# EAGLE design fanos (EAGLE 8.4.1)
CNAME: Fanos 9W LED Bulb Controller; CREVISION: 0.1; DESIGNER: R.E by drubicza/WTHLab
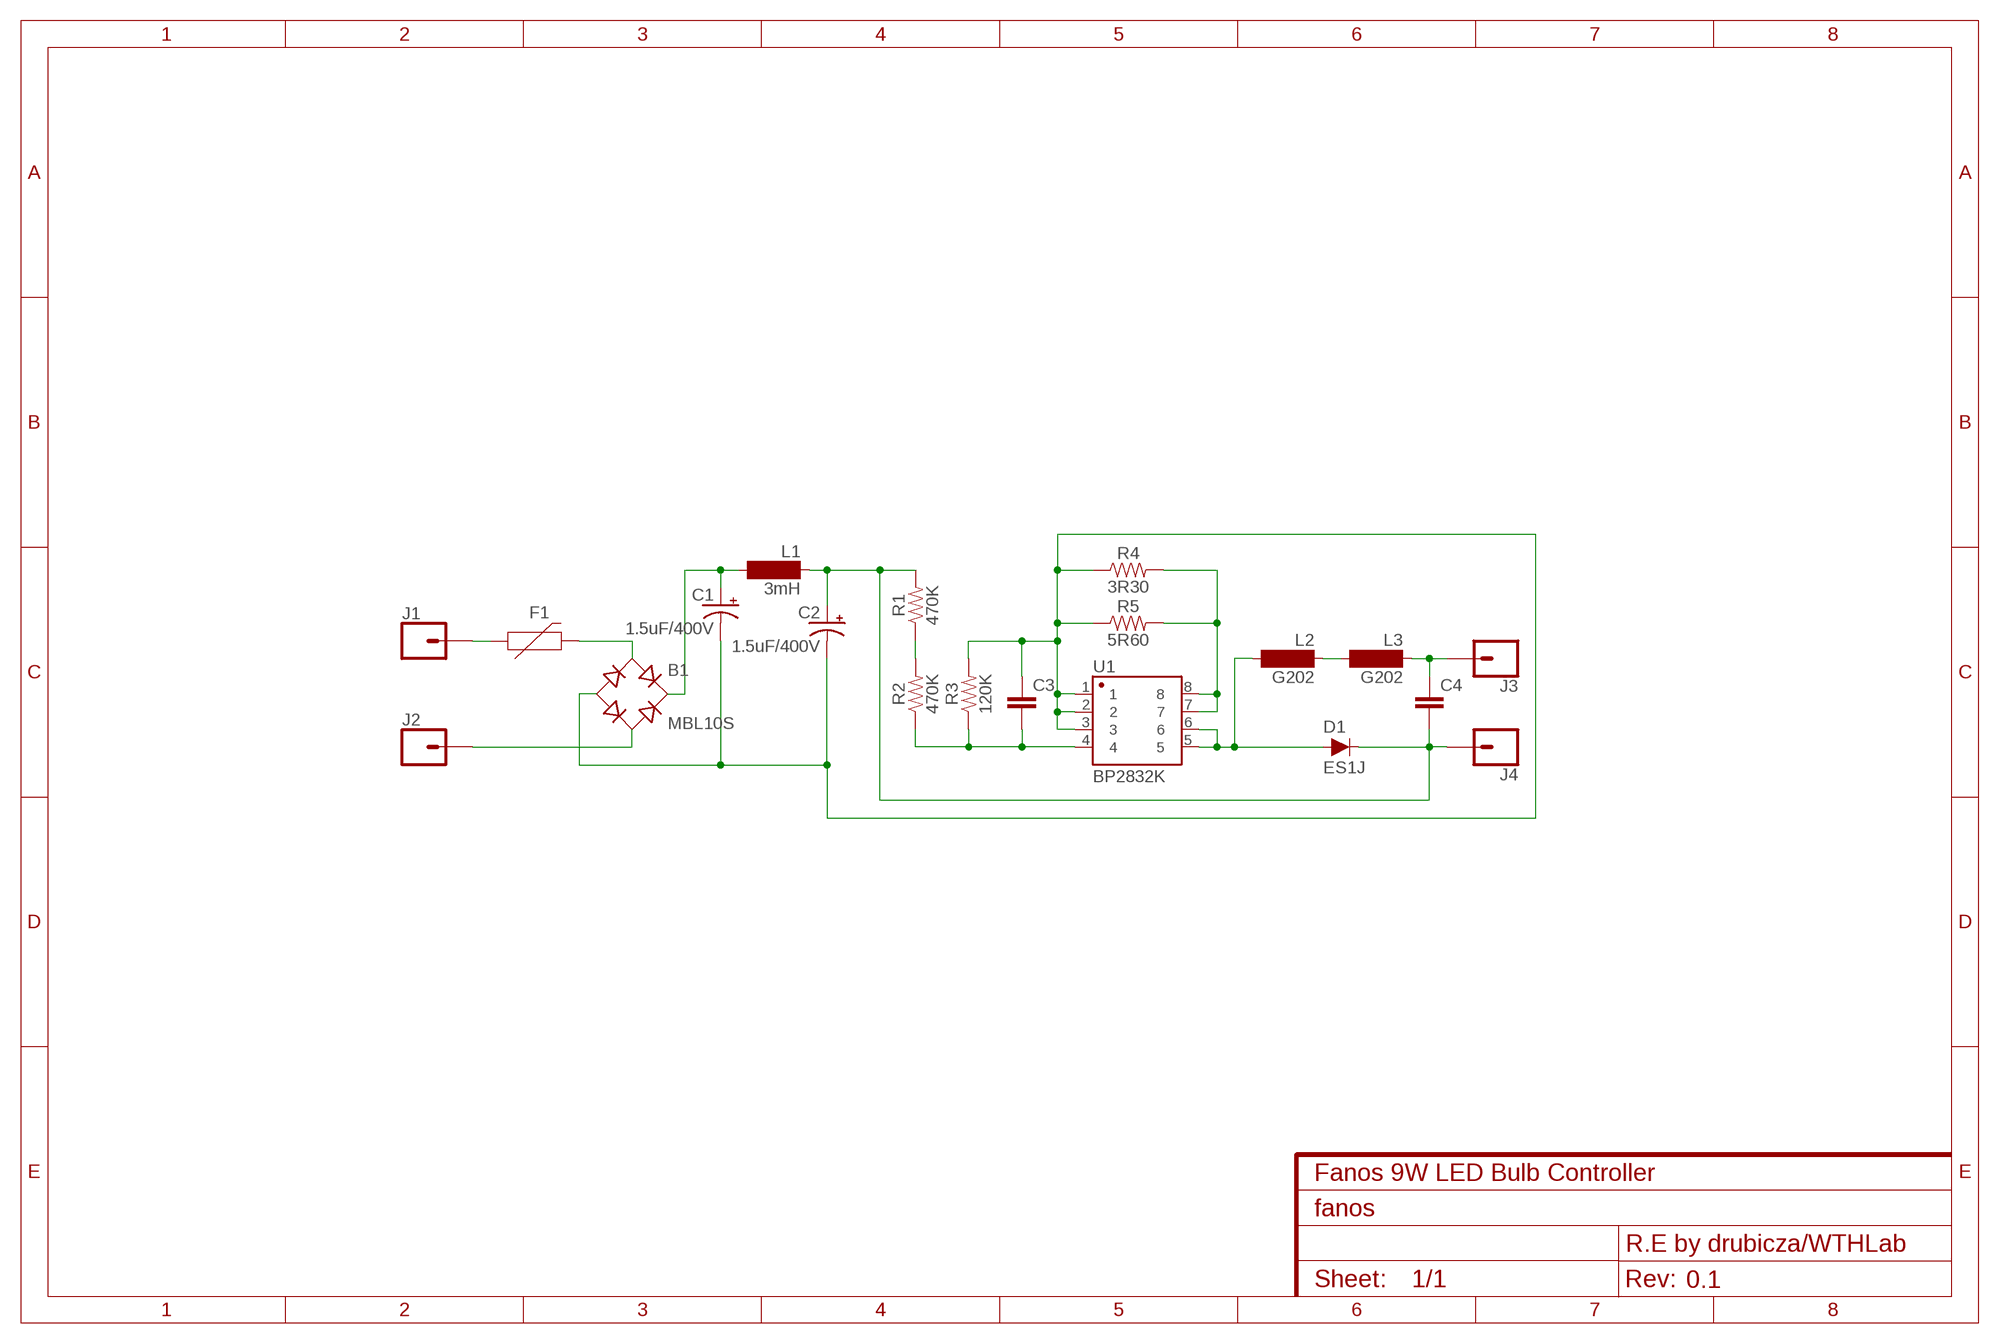
[diagram p0: schematic, sheet 1]

## Parts
B1  MBL10S  MB1S  [SOIC-4]
C1  1.5uF/400V  1000UF-RADIAL-5MM-25V-20%  [CPOL-RADIAL-5MM-10MM]
C2  1.5uF/400V  1000UF-RADIAL-5MM-25V-20%  [CPOL-RADIAL-5MM-10MM]
C3  0.18UF-0603-10V-10%  [0603]
C4  0.33UF/330NF-0805-50V-10%  [0805]
D1  ES1J  DIODE-BAS16J  [SOD-323]
F1  PPTC_PTH  [PTH]
J1  CONN_01  [1X01]
J2  CONN_01  [1X01]
J3  CONN_01  [1X01]
J4  CONN_01  [1X01]
L1  3mH  BS11  [BS11]
L2  G202  BS11  [BS11]
L3  G202  BS11  [BS11]
R1  470K  0.3OHM-0805-1/8W-1%  [0805]
R2  470K  0.3OHM-0805-1/8W-1%  [0805]
R3  120K  0.05OHM-0603-1/5W-1%  [0603]
R4  3R30  0.1OHM-1210-1/2W-1%  [1210]
R5  5R60  0.1OHM-1210-1/2W-1%  [1210]
U1  BP2832K  GENERIC-SOIC8MSGEQ7N-FILTER  [SO08]

## Nets
N$1: B1.~2(AC2) J2.1
N$2: F1.P$1 J1.1
N$3: B1.~1(AC1) F1.P$2
N$4: B1.- C1.- C2.- C3.1 R3.2 R4.1 R5.1 U1.1 U1.2 U1.3
N$6: B1.+ C1.+ L1.2
N$8: C3.2 R2.1 R3.1 U1.4
N$9: R1.1 R2.2
N$10: R4.2 R5.2 U1.7 U1.8
N$11: D1.A L2.2 U1.5 U1.6
N$12: C2.+ C4.2 D1.C J4.1 L1.1 R1.2
N$13: L2.1 L3.2
N$14: C4.1 J3.1 L3.1

## Library data of the parts
B1 = rectifier:MB*S: Bridge Rectifier Source: http://www.fairchildsemi.com/ds/MB/MB6S.pdf
C1 C2 = SparkFun-Capacitors:1000UF: 1,000µF/1mF ceramic capacitors A capacitor is a passive two-terminal electrical component used to store electrical energy temporarily in an electric field. CAP-08070; PROD_ID: CAP-09538; VALUE: 1mF
C3 = SparkFun-Capacitors:0.18UF: 0.18µF ceramic capacitor A capacitor is a passive two-terminal electrical component used to store electrical energy temporarily in an electric field.; PROD_ID: CAP-12380; VALUE: 0.18uF
C4 = SparkFun-Capacitors:0.33UF/330NF: 0.33µF/330nF ceramic capacitors A capacitor is a passive two-terminal electrical component used to store electrical energy temporarily in an electric field.; PROD_ID: CAP-08469; VALUE: 0.33µF
D1 = SparkFun-DiscreteSemi:DIODE: Diode These are standard reverse protection diodes and small signal diodes. SparkFun Products: SparkFun SparkPunk Sound Kit <https://www.sparkfun.com/products/11177> SparkFun ESP8266 Thing <https://www.sparkfun.com/products/13231>; PROD_ID: DIO-09646; VALUE: 250mA/100V
F1 = SparkFun-Fuses:PPTC: Resettable Fuse PPTC Resettable Fuse. Really a sort of resistor with a polymeric positive temperature coefficient whose resistance increases dramatically with an increase in temperature. When heated by the power passing through the resistance rises causing the current to be limited, protecting the circuit. This is achieved by the transition of the polymer from a crystalline to an amorphous state where the conductive carbon separates breaking the conductive pathways found in the cool crystalline structure. When a PPTC cools back down it resumes conducting letting the circuit turn back on. SparkFun Products: SparkFun RedBoard - Programmed with Arduino <https://www.sparkfun.com/products/12757> Pro Micro - 5V/16MHz <https://www.sparkfun.com/products/12640> Arduino Pro 328 - 5V/16MHz <https://www.sparkfun.com/products/10915> MP3 Trigger <https://www.sparkfun.com/products/13720>; PROD_ID: RES-08490; VALUE: 72V/0.25A
J1-J4 = SparkFun-Connectors:CONN_01: Single connection point. Often used as Generic Header-pin footprint for 0.1 inch spaced/style header connections On any of the 0.1 inch spaced packages, you can populate with these: Break Away Headers - Straight <https://www.sparkfun.com/products/116> (PRT-00116) Break Away Male Headers - Right Angle <https://www.sparkfun.com/products/553> (PRT-00553) Female Headers <https://www.sparkfun.com/products/115> (PRT-00115) Break Away Headers - Machine Pin <https://www.sparkfun.com/products/117> (PRT-00117) Break Away Female Headers - Swiss Machine Pin <https://www.sparkfun.com/products/743> (PRT-00743) This device is also useful as a general connection point to wire up your design to another part of your project. Our various solder wires solder well into these plated through hole pads. Hook-Up Wire - Assortment (Stranded, 22 AWG) <https://www.sparkfun.com/products/11375> (PRT-11375) Hook-Up Wire - Assortment (Solid Core, 22 AWG) <https://www.sparkfun.com/products/11367> (PRT-11367) View the entire wire category on our website here <https://www.sparkfun.com/categories/141> Special notes: SMTSO-256-ET is a "flush mount" nut for a 4-40 screw. We mostly use this on specialty testbeds; it is a nice way to connect hardware to your PCB at an adjustable hieght. Also note, the SNAP packages are for using a snappable style connector. We sell a baggie of snaps and they are also used on two LilyPad designs: Snap Assortment - 30 pack (male and female) <https://www.sparkfun.com/products/11347> (DEV-11347) LilyPad Arduino SimpleSnap <https://www.sparkfun.com/products/10941> (DEV-10941) LilyPad SimpleSnap Protoboard <https://www.sparkfun.com/products/10940> (DEV-10940)
L1-L3 = inductor-neosid:BS: INDUCTOR nominal inductance, magnetically screened; OC_FARNELL: unknown; OC_NEWARK: unknown
R1 R2 = SparkFun-Resistors:0.3OHM: 0.3Ω resistor A resistor is a passive two-terminal electrical component that implements electrical resistance as a circuit element. Resistors act to reduce current flow, and, at the same time, act to lower voltage levels within circuits. - Wikipedia; PROD_ID: RES-11622; VALUE: 0.3
R3 = SparkFun-Resistors:0.05OHM: 0.05Ω resistor A resistor is a passive two-terminal electrical component that implements electrical resistance as a circuit element. Resistors act to reduce current flow, and, at the same time, act to lower voltage levels within circuits. - Wikipedia; PROD_ID: RES-12535; VALUE: 0.05
R4 R5 = SparkFun-Resistors:0.1OHM: 0.1Ω resistor A resistor is a passive two-terminal electrical component that implements electrical resistance as a circuit element. Resistors act to reduce current flow, and, at the same time, act to lower voltage levels within circuits. - Wikipedia; PROD_ID: RES-12374; VALUE: 0.1
U1 = SparkFun-Retired:GENERIC-SOIC8: A placeholder for generic narrow & wide SOIC8 foorptints - used on the DIP adapter board. Has strange reference to IC-10141, a Seven Band Graphic Equalizer Display Filter SOIC-8 VFP: IC-10141; PROD_ID: IC-10141

## Board
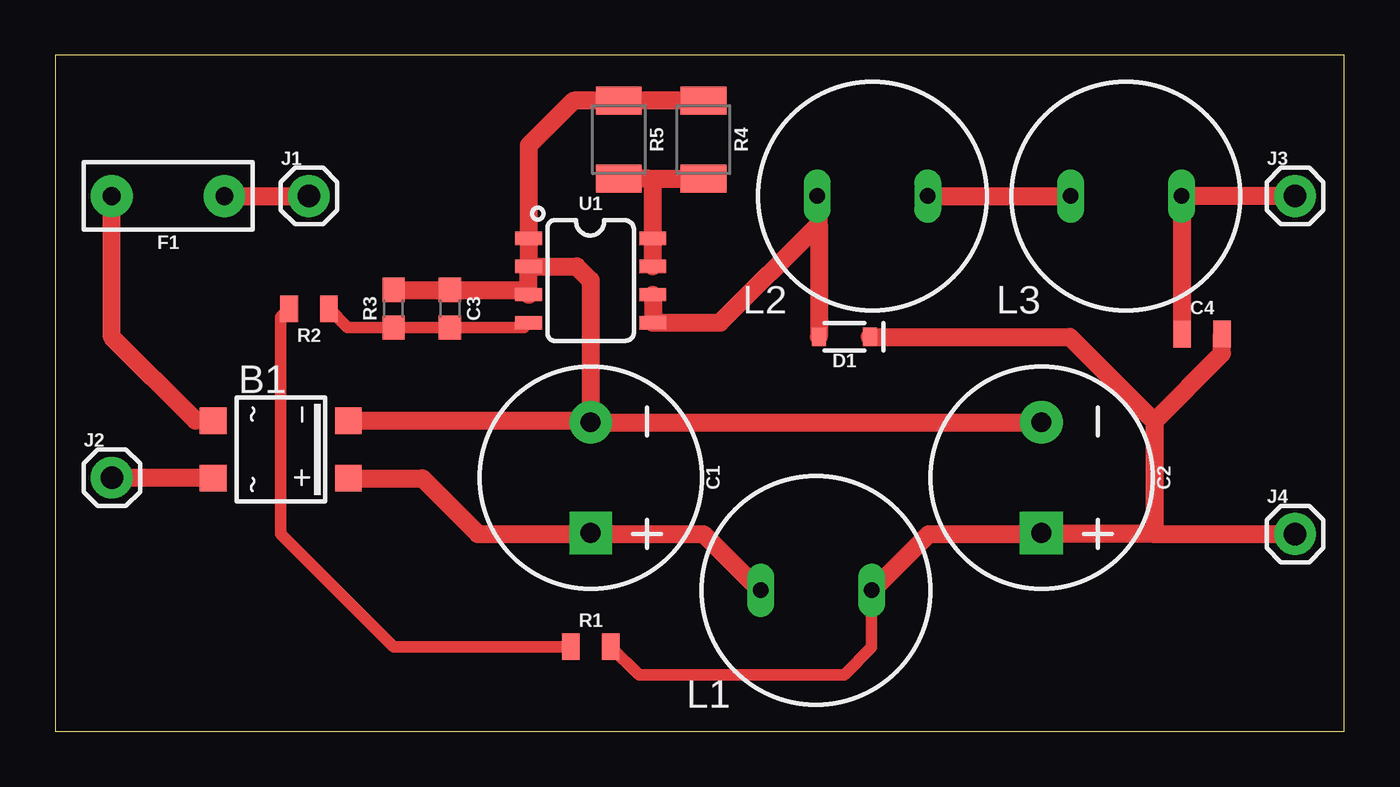
[diagram p1: board, top side]

Size 58.09 x 30.47 mm. Coordinates in mm from the lower left corner, seen from the top.
Outline: 0,0 58.09,0 58.09,30.47 0,30.47 0,0
Copper layers (1*16): Top 0.035mm / dielectric 1.5mm / Bottom 0.035mm
Design rules "default": minimum track width 6mil, minimum drill 0.35mm, track to track 6mil, track to pad 6mil, pad to pad 6mil, via to via 6mil, smd to smd 6mil, copper to edge 40mil, drill to drill 6mil, minimum pad ring 10mil, minimum via ring 8mil, stop-mask expansion 4mil, vias tented up to drill 0mil, thermal gap 10mil

### Footprints (pad centres in the part's own frame; a part is rotated, then mirrored left to right if it is on the bottom)
SOIC-4 = smd 1.2 x 1.2: + 1.3,3.05; - -1.3,3.05; ~1 -1.3,-3.05; ~2 1.3,-3.05
CPOL-RADIAL-5MM-10MM = drill 0.9 pad 1.93 square: + 2.5,0 | drill 0.9 pad 1.93: - -2.5,0
0603 = smd 1.1 x 1: 1 -0.85,0; 2 0.85,0
0805 = smd 0.8 x 1.2: 1 -0.9,0; 2 0.9,0
SOD-323 = smd 0.63 x 0.83: A 1.15,0; C -1.15,0
PTH = drill 0.8 pad 1.88: P$1 -2.54,0; P$2 2.54,0
1X01 = drill 1.016 pad 1.88: 1 0,0
BS11 = drill 0.7 long: 1 -2.5,0; 2 2.5,0
1210 = smd 1.27 x 2.06: 1 -1.755,0; 2 1.755,0
SO08 = smd 0.6 x 1.2: 1 -1.905,-2.8; 2 -0.635,-2.8; 3 0.635,-2.8; 4 1.905,-2.8; 5 1.905,2.8; 6 0.635,2.8; 7 -0.635,2.8; 8 -1.905,2.8

### Placement (x,y rotation side)
B1  10.16,12.7 270 top
C1  24.13,11.43 270 top
C2  44.45,11.43 270 top
C3  17.78,19.05 270 top
C4  51.69,17.91 0 top
D1  35.56,17.78 180 top
F1  5.08,24.13 180 top
J1  11.43,24.13 0 top
J2  2.54,11.43 0 top
J3  55.88,24.13 0 top
J4  55.88,8.89 0 top
L1  34.29,6.35 180 top
L2  36.83,24.13 180 top
L3  48.26,24.13 180 top
R1  24.13,3.81 0 top
R2  11.43,19.05 180 top
R3  15.24,19.05 90 top
R4  29.21,26.67 270 top
R5  25.4,26.67 270 top
U1  24.13,20.32 270 top

### Tracks (layer width: path | path; a pad name or v marks a point on that pad's centre or on a via)
N$1
  Top 0.813: J2.1 7.08,11.43 B1.~2
N$2
  Top 0.813: F1.P$1 J1.1
N$3
  Top 0.813: B1.~1 6.32,14 2.54,17.78 F1.P$2
N$4
  Top 0.813: B1.- 24.06,14 C1.- | C1.- C2.- | R4.1 R5.1 23.34,28.43 21.33,26.41 U1.1 U1.2 | U1.2 23.5,20.95 24.13,20.32 C1.- | R3.2 C3.1 21.11,19.9 U1.3 U1.2
N$6
  Top 0.813: B1.+ 16.54,11.4 19.05,8.89 24.09,8.89 C1.+ 24.17,8.89 29.21,8.89 31.75,6.35 L1.2
N$8
  Top 0.508: R2.1 13.18,18.2 R3.1 C3.2 21.11,18.2 U1.4
N$9
  Top 0.508: R1.1 15.24,3.81 10.16,8.89 10.16,18.68 R2.2
N$10
  Top 0.813: 26.67,24.91 R5.2 | 26.67,24.91 R4.2 | U1.7 U1.8 26.93,24.66 26.67,24.91
N$11
  Top 0.813: 34.41,22.86 D1.A | 34.41,22.86 34.41,24.05 L2.2 | U1.6 U1.5 29.96,18.41 34.41,22.86
N$12
  Top 0.508: L1.1 36.79,3.77 35.56,2.54 26.3,2.54 R1.2
  Top 0.813: L1.1 36.83,6.35 39.37,8.89 44.41,8.89 C2.+ 44.49,8.89 49.53,8.89 | 49.53,8.89 J4.1 | D1.C 45.72,17.78 49.53,13.97 | 49.53,13.97 49.53,8.89 | 49.53,13.97 52.59,17.03 C4.2
N$13
  Top 0.813: L2.1 L3.2
N$14
  Top 0.813: C4.1 50.79,24.1 L3.1 J3.1